# EAGLE design bno055 (EAGLE 9.6.2)
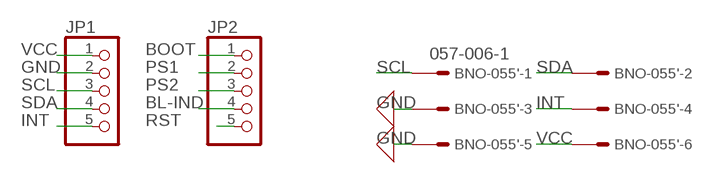
[diagram p0: schematic, sheet 1]

## Parts
BNO-055'  057-006-1  [057-006-1]
JP1  PINHD-1X5  [1X05]
JP2  PINHD-1X5  [1X05]

## Nets
BL-IND: JP2.4
BOOT: JP2.1
GND: BNO-055'.3 BNO-055'.5 JP1.2
INT: BNO-055'.4 JP1.5
PS1: JP2.2
PS2: JP2.3
RST: JP2.5
SCL: BNO-055'.1 JP1.3
SDA: BNO-055'.2 JP1.4
VCC: BNO-055'.6 JP1.1

## Library data of the parts
BNO-055' = con-panduit:057-006-: CONNECTOR 6-pin series 057 contact pc board low profile headers; OC_FARNELL: unknown; OC_NEWARK: unknown
JP1 JP2 = pinhead:PINHD-1X5: PIN HEADER

## Board
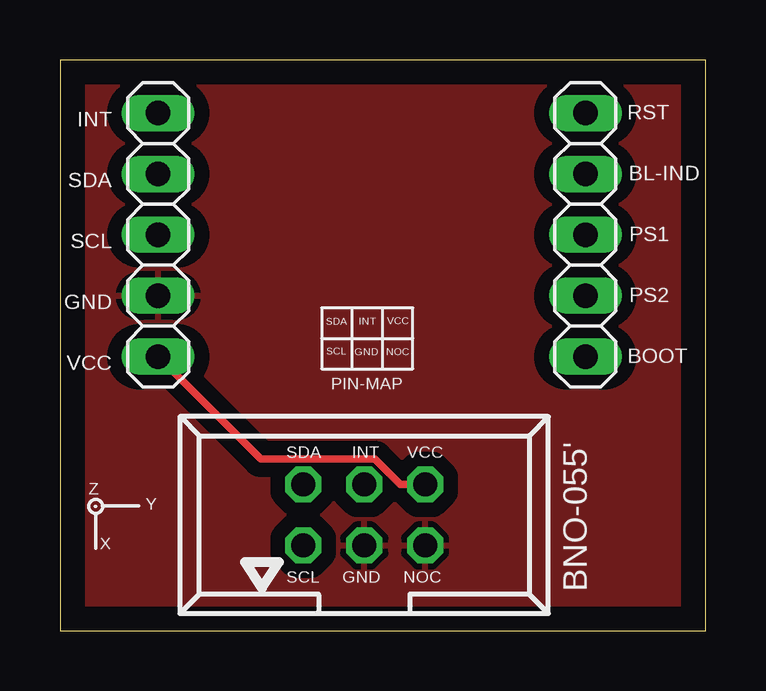
[diagram p1: board, top side]
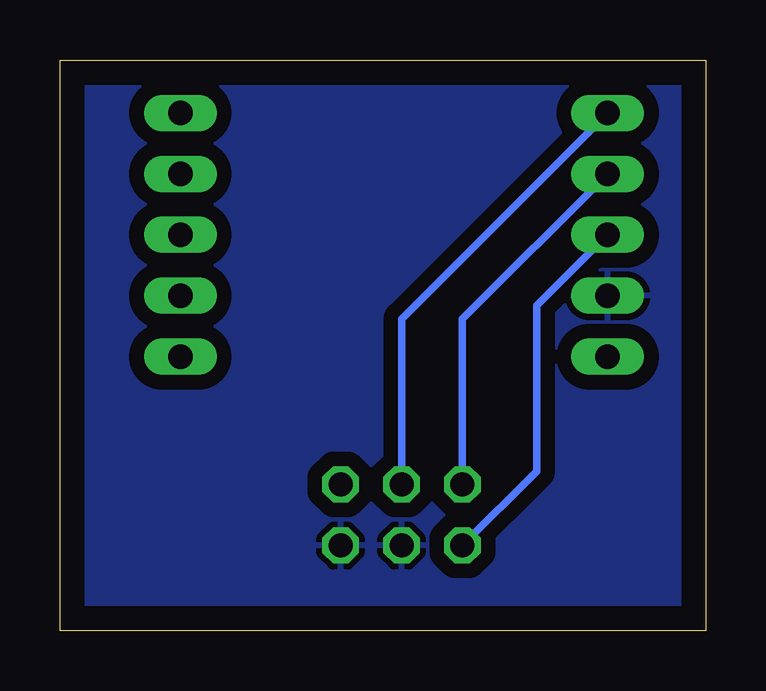
[diagram p2: board, bottom side, seen from below]

Size 26.9 x 23.8 mm. Coordinates in mm from the lower left corner, seen from the top.
Outline: 0,0 26.9,0 26.9,23.8 0,23.8 0,0
Copper layers (1*16): Top 0.035mm / dielectric 1.5mm / Bottom 0.035mm
Design rules "default": minimum track width 6mil, minimum drill 0.35mm, track to track 6mil, track to pad 6mil, pad to pad 6mil, via to via 6mil, smd to smd 6mil, copper to edge 40mil, drill to drill 6mil, minimum pad ring 10mil, minimum via ring 8mil, stop-mask expansion 4mil, vias tented up to drill 0mil, thermal gap 10mil

### Footprints (pad centres in the part's own frame; a part is rotated, then mirrored left to right if it is on the bottom)
057-006-1 = drill 1 octagon: 1 -2.54,-1.27; 2 -2.54,1.27; 3 0,-1.27; 4 0,1.27; 5 2.54,-1.27; 6 2.54,1.27
1X05 = drill 1.016 long: 1 -5.08,0; 2 -2.54,0; 3 0,0; 4 2.54,0; 5 5.08,0

### Placement (x,y rotation side)
BNO-055'  12.67,4.83 0 top
JP1  4.09,16.51 90 top
JP2  21.89,16.51 90 top

### Tracks (layer width: path | path; a pad name or v marks a point on that pad's centre or on a via)
GND
  pour Bottom (isolate 0.61, rank 2): -0.15,24 27.03,24 27.03,-0.13 -0.15,-0.13
  pour Top (isolate 0.61, rank 2): -0.03,24.13 27.41,24.13 27.41,-0.51 -0.53,-0.51 -0.53,24.13
INT
  Bottom 0.305: JP1.5 12.67,13.01 BNO-055'.4
SCL
  Bottom 0.305: BNO-055'.1 7.04,6.65 7.04,13.56 JP1.3
SDA
  Bottom 0.305: JP1.4 10.13,13.01 BNO-055'.2
VCC
  Top 0.305: JP1.1 8.36,7.16 13.11,7.16 14.17,6.1 BNO-055'.6

### Text on the board
tNames: INT | RST | SDA | BL-IND | SCL | PS1 | GND | PS2 | SDA | INT | VCC | SCL | GND | NOC | BOOT | VCC | PIN-MAP | SDA | INT | VCC | Z | Y | X | SCL | GND | NOC